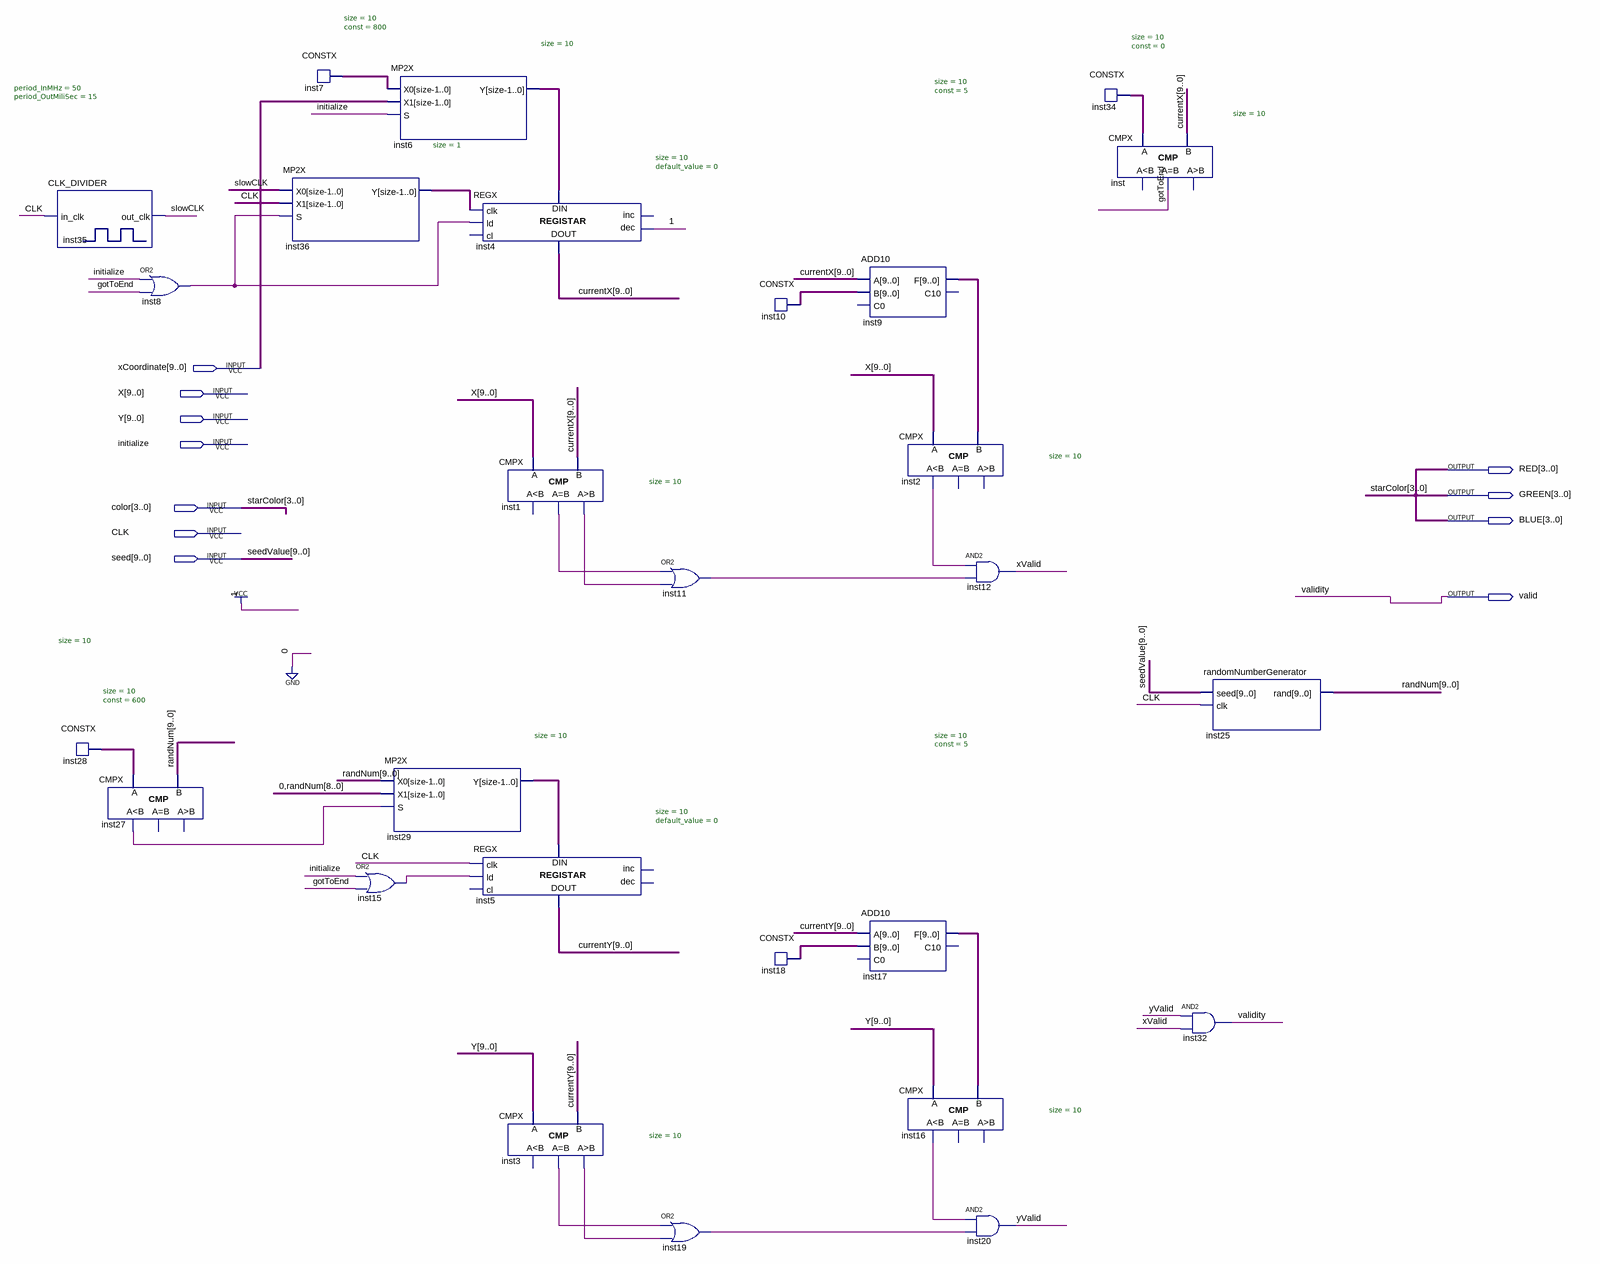
[diagram p0: schematic sheet]
// Quartus schematic starModule.bdf as structural Verilog: 27 symbols, 11 pins
module starModule (
  input  [9:0] xCoordinate,
  input  [9:0] X,
  input  [9:0] Y,
  input  initialize,
  input  [3:0] color,
  input  CLK,
  input  [9:0] seed,
  output [3:0] RED,
  output [3:0] GREEN,
  output [3:0] BLUE,
  output valid
);

  wire gotToEnd, inst1_eq, inst1_gr, inst2_ls, inst3_eq, inst3_gr, inst8_out, inst11_out, inst15_out,
       inst16_ls, inst19_out, inst27_ls, inst36_y, slowCLK, xValid, yValid;
  wire [9:0] currentX, currentY, inst6_y, inst7_data, inst9_f, inst10_data, inst17_f, inst18_data,
       inst28_data, inst29_y, inst34_data, randNum;

  CLK_DIVIDER #(.period_InMHz(50), .period_OutMiliSec(15)) inst35 (.in_clk(CLK), .out_clk(slowCLK));
  CONSTX #(.size(10), .\const (600)) inst28 (.data(inst28_data));
  CMPX #(.size(10)) inst27 (.A(inst28_data), .B(randNum), .ls(inst27_ls));  // open: eq, gr
  or inst8 (inst8_out, initialize, gotToEnd);
  CONSTX #(.size(10), .\const (800)) inst7 (.data(inst7_data));
  MP2X #(.size(1)) inst36 (.X0(slowCLK), .X1(CLK), .S(inst8_out), .Y(inst36_y));
  or inst15 (inst15_out, initialize, gotToEnd);
  MP2X #(.size(10)) inst6 (.X0(inst7_data), .X1(xCoordinate), .S(initialize), .Y(inst6_y));
  MP2X #(.size(10)) inst29 (.X0(randNum), .X1({1'b0, randNum[8:0]}), .S(inst27_ls), .Y(inst29_y));
  REGX #(.size(10), .default_value(0)) inst4 (
    .clk(inst36_y), .ld(inst8_out), .dec(1'b1), .data_in(inst6_y), .data_out(currentX));  // open: cl, inc
  CMPX #(.size(10)) inst1 (.A(X), .B(currentX), .eq(inst1_eq), .gr(inst1_gr));  // open: ls
  REGX #(.size(10), .default_value(0)) inst5 (
    .clk(CLK), .ld(inst15_out), .data_in(inst29_y), .data_out(currentY));  // open: cl, inc, dec
  CMPX #(.size(10)) inst3 (.A(Y), .B(currentY), .eq(inst3_eq), .gr(inst3_gr));  // open: ls
  or inst11 (inst11_out, inst1_eq, inst1_gr);
  or inst19 (inst19_out, inst3_eq, inst3_gr);
  CONSTX #(.size(10), .\const (5)) inst10 (.data(inst10_data));
  CONSTX #(.size(10), .\const (5)) inst18 (.data(inst18_data));
  ADD10 inst9 (.A(currentX), .B(inst10_data), .F(inst9_f));  // open: C0, C10
  ADD10 inst17 (.A(currentY), .B(inst18_data), .F(inst17_f));  // open: C0, C10
  CMPX #(.size(10)) inst2 (.A(X), .B(inst9_f), .ls(inst2_ls));  // open: eq, gr
  CMPX #(.size(10)) inst16 (.A(Y), .B(inst17_f), .ls(inst16_ls));  // open: eq, gr
  and inst12 (xValid, inst2_ls, inst11_out);
  and inst20 (yValid, inst16_ls, inst19_out);
  CONSTX #(.size(10), .\const (0)) inst34 (.data(inst34_data));
  CMPX #(.size(10)) inst (.A(inst34_data), .B(currentX), .eq(gotToEnd));  // open: ls, gr
  randomNumberGenerator inst25 (.seed(seed), .clk(CLK), .\rand (randNum));
  and inst32 (valid, yValid, xValid);

  assign BLUE = color;
  assign GREEN = color;
  assign RED = color;

  // Other names for the same wires on the sheet: starColor[3:0] = color; seedValue[9:0] = seed; validity = valid
endmodule
